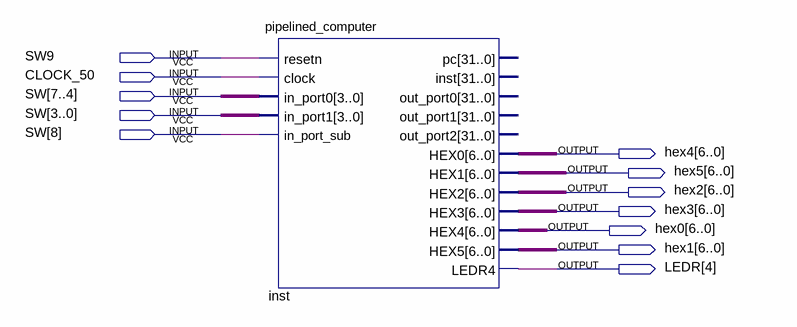
[diagram p0: schematic sheet]
// Quartus schematic computer_pipeline.bdf as structural Verilog: 1 symbols, 12 pins
module computer_pipeline (
  input  SW9,
  input  CLOCK_50,
  input  [8:0] SW,
  output [6:0] hex4,
  output [6:0] hex5,
  output [6:0] hex2,
  output [6:0] hex3,
  output [6:0] hex0,
  output [6:0] hex1,
  output [4:4] LEDR
);

  pipelined_computer inst (
    .resetn(SW9), .clock(CLOCK_50), .in_port0(SW[7:4]), .in_port1(SW[3:0]), .in_port_sub(SW[8]), .HEX0(hex4),
    .HEX1(hex5), .HEX2(hex2), .HEX3(hex3), .HEX4(hex0), .HEX5(hex1), .LEDR4(LEDR[4]));  // open: pc, inst, out_port0, out_port1, out_port2
endmodule
